# Altium schematic sheet STM32.SchDoc
size 228 x 152 mm
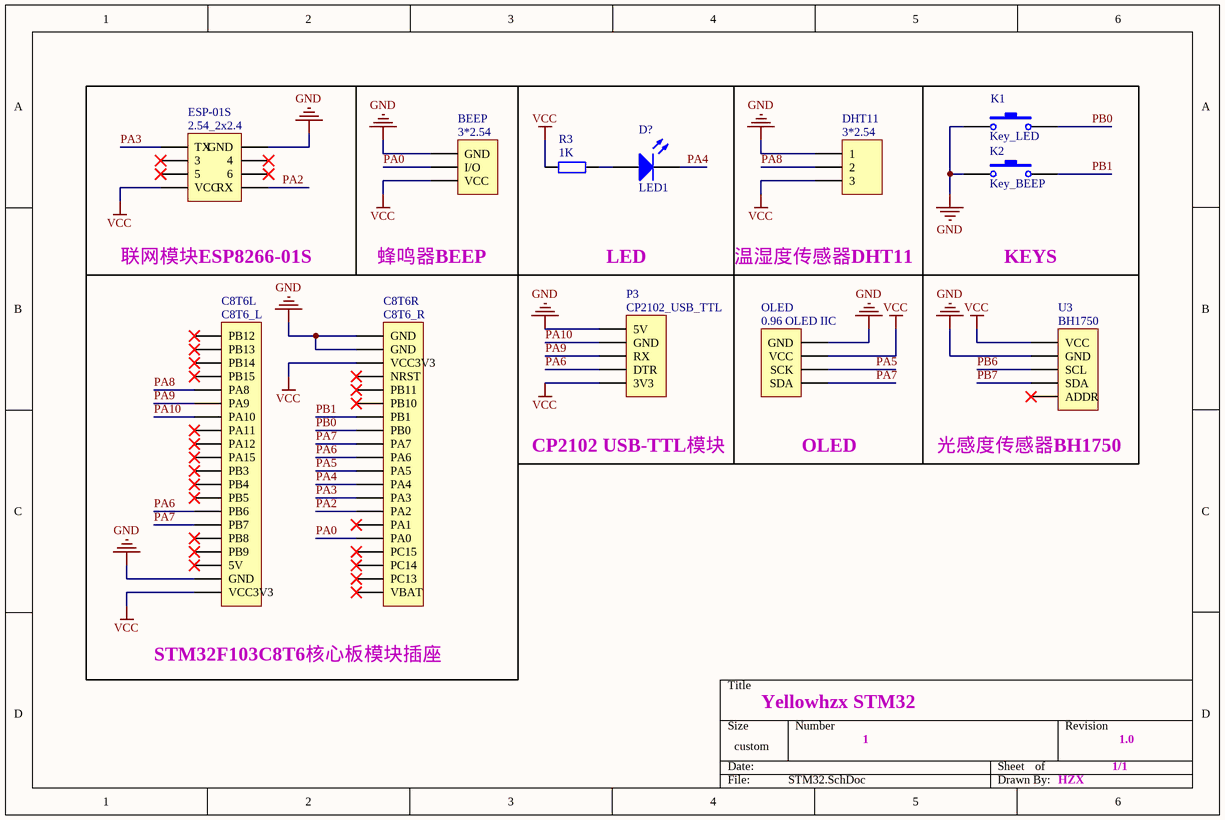
[diagram p0: STM32.SchDoc]

## Parts
BEEP  3*2.54  [HDR1X3]
C8T6_L  C8T6L  [HDR1X20]
C8T6_R  C8T6R  [HDR1X20]
D?  LED1  [LED-1]
DHT11  3*2.54  [HDR1X3]
ESP-01S  2.54_2x2.4  [HDR2X4]
K1  Key_LED  [SPST-2]
K2  Key_BEEP  [SPST-2]
OLED  0.96 OLED IIC  [HDR1X4]
P3  CP2102_USB_TTL  [HDR1X5]
R3  value 1K  [AXIAL-0.4]
U3  BH1750  [HDR1X5]

## Blocks framed on the sheet
联网模块ESP8266-01S: ESP-01S

## Nets
GND: BEEP.1(GND) C8T6_L.19(GND) C8T6_R.1(GND) C8T6_R.2(GND) DHT11.1 ESP-01S.2(GND) K1.1 K2.1 OLED.1(GND) P3.1(5V) U3.2(GND)
VCC: BEEP.3(VCC) C8T6_L.20(VCC3V3) C8T6_R.3(VCC3V3) DHT11.3 ESP-01S.7(VCC) OLED.2(VCC) P3.5(3V3) R3.1 U3.1(VCC)
PA0: BEEP.2(I/O) C8T6_R.16(PA0)
PA2: C8T6_R.14(PA2) ESP-01S.8(RX)
PA3: C8T6_R.13(PA3) ESP-01S.1(TX)
PA4: C8T6_R.12(PA4) D?.2(K)
PA5: C8T6_R.11(PA5) OLED.3(SCK)
PA6: C8T6_L.14(PB6) C8T6_R.10(PA6) P3.4(DTR)
PA7: C8T6_L.15(PB7) C8T6_R.9(PA7) OLED.4(SDA)
PA8: C8T6_L.5(PA8) DHT11.2
PA9: C8T6_L.6(PA9) P3.3(RX)
PA10: C8T6_L.7(PA10) P3.2(GND)
PB0: C8T6_R.8(PB0) K1.2
PB1: C8T6_R.7(PB1) K2.2
PB6: U3.3(SCL)
PB7: U3.4(SDA)
NetD?_1: D?.1(A) R3.2

Not connected (* = marked no-connect by the designer): C8T6_L 1(PB12)* 2(PB13)* 3(PB14)* 4(PB15)* 8(PA11)* 9(PA12)* 10(PA15)* 11(PB3)* 12(PB4)* 13(PB5)* 16(PB8)* 17(PB9)* 18(5V)*; C8T6_R 4(NRST)* 5(PB11)* 6(PB10)* 15(PA1)* 17(PC15)* 18(PC14)* 19(PC13)* 20(VBAT)*; ESP-01S 3* 4* 5* 6*; U3 5(ADDR)*

## Notes on the sheet
- 蜂鸣器BEEP
- LED
- 温湿度传感器DHT11
- KEYS
- (near P3) CP2102 USB-TTL模块
- (near OLED) OLED
- (near U3) 光感度传感器BH1750
- STM32F103C8T6核心板模块插座
- Yellowhzx STM32
- 1
- 1/1
- 1.0
- HZX

## Library data of the parts
BEEP DHT11 = Header 3: Header, 3-Pin; LatestRevisionDate: 17-Jul-2002; LatestRevisionNote: Re-released for DXP Platform.; Publisher: Altium Limited
C8T6_L C8T6_R = Header 20: Header, 20-Pin; LatestRevisionDate: 17-Jul-2002; LatestRevisionNote: Re-released for DXP Platform.; Publisher: Altium Limited
D? = LED1: Typical RED GaAs LED; Published: 8-Jun-2000; LatestRevisionDate: 08-Jul-2005; LatestRevisionNote: Mech Layer 1 removed.; PackageReference: LED-1; Publisher: Altium Limited; PackageDescription: LED; 2 Leads
ESP-01S = Header 4X2: Header, 4-Pin, Dual row; LatestRevisionDate: 17-Jul-2002; LatestRevisionNote: Re-released for DXP Platform.; Publisher: Altium Limited
K1 K2 = SW-PB: Switch; Published: 24-Mar-1999; LatestRevisionDate: 17-Jul-2002; LatestRevisionNote: Re-released for DXP Platform.; PackageReference: SPST-2; Publisher: Altium Limited; PackageDescription: Switch; 2 Leads
OLED = Header 4: Header, 4-Pin; LatestRevisionDate: 17-Jul-2002; LatestRevisionNote: Re-released for DXP Platform.; Publisher: Altium Limited
P3 U3 = Header 5: Header, 5-Pin; LatestRevisionDate: 17-Jul-2002; LatestRevisionNote: Re-released for DXP Platform.; Publisher: Altium Limited
R3 = Res2: Resistor; Published: 8-Jun-2000; LatestRevisionDate: 17-Jul-2002; LatestRevisionNote: Re-released for DXP Platform.; PackageReference: AXIAL-0.4; Publisher: Altium Limited; PackageDescription: Axial Device, Thru-Hole; 2 Leads; 0.4 in Pin Spacing